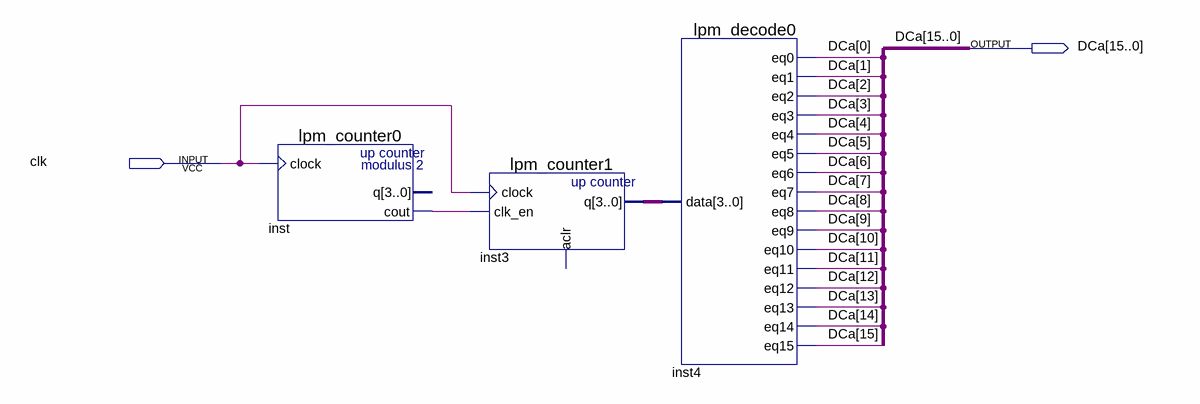
[diagram p0: schematic sheet]
// Quartus schematic DCA_gen.bdf as structural Verilog: 3 symbols, 2 pins
module DCA_gen (
  input  clk,
  output [15:0] DCa
);

  wire inst_cout;
  wire [3:0] inst3_q;

  lpm_counter0 inst (.clock(clk), .cout(inst_cout));  // open: q
  lpm_counter1 inst3 (.clock(clk), .clk_en(inst_cout), .q(inst3_q));  // open: aclr
  lpm_decode0 inst4 (
    .data(inst3_q), .eq0(DCa[0]), .eq1(DCa[1]), .eq2(DCa[2]), .eq3(DCa[3]), .eq4(DCa[4]), .eq5(DCa[5]),
    .eq6(DCa[6]), .eq7(DCa[7]), .eq8(DCa[8]), .eq9(DCa[9]), .eq10(DCa[10]), .eq11(DCa[11]), .eq12(DCa[12]),
    .eq13(DCa[13]), .eq14(DCa[14]), .eq15(DCa[15]));
endmodule
